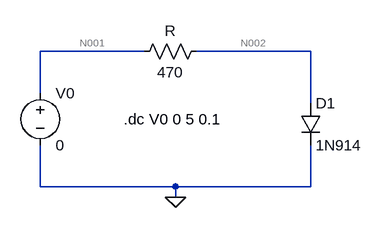
[diagram p0: schematic 1.asc]
1.asc, the LTspice schematic file:
Version 4
SHEET 1 880 680
WIRE 112 -112 -48 -112
WIRE 368 -112 192 -112
WIRE -48 -48 -48 -112
WIRE 368 -32 368 -112
WIRE -48 96 -48 32
WIRE 160 96 -48 96
WIRE 368 96 368 32
WIRE 368 96 160 96
WIRE 160 112 160 96
FLAG 160 112 0
SYMBOL res 208 -128 R90
WINDOW 0 0 56 VBottom 2
WINDOW 3 32 56 VTop 2
SYMATTR InstName R
SYMATTR Value 470
SYMBOL voltage -48 -64 R0
WINDOW 123 0 0 Left 0
WINDOW 39 0 0 Left 0
SYMATTR InstName V0
SYMATTR Value 0
SYMBOL diode 352 -32 R0
SYMATTR InstName D1
SYMATTR Value 1N914
TEXT 80 -8 Left 2 !.dc V0 0 5 0.1

The netlist it stands for:
* 1.asc
R N002 N001 470
V0 N001 0 0
D1 N002 0 1N914
.model D D
.lib standard.dio
.dc V0 0 5 0.1
.backanno
.end

* Results of the author's LTspice run, read from the files saved beside the schematic
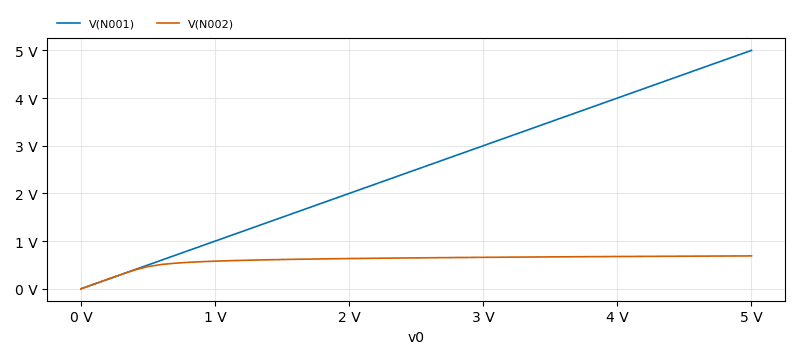
[diagram p1: DC transfer characteristic of 1.asc, plotted from the saved traces]
* DC transfer characteristic, 1 run:
*   V(N001): 0 V at v0=0 V, 5 V at v0=5 V, min 0 V, max 5 V
*   V(N002): 0 V at v0=0 V, 689.8 mV at v0=5 V, min 0 V, max 689.8 mV